# Altium schematic sheet 12V_Jetson.SchDoc
size A; SheetNumber: 3; SheetTotal: 9
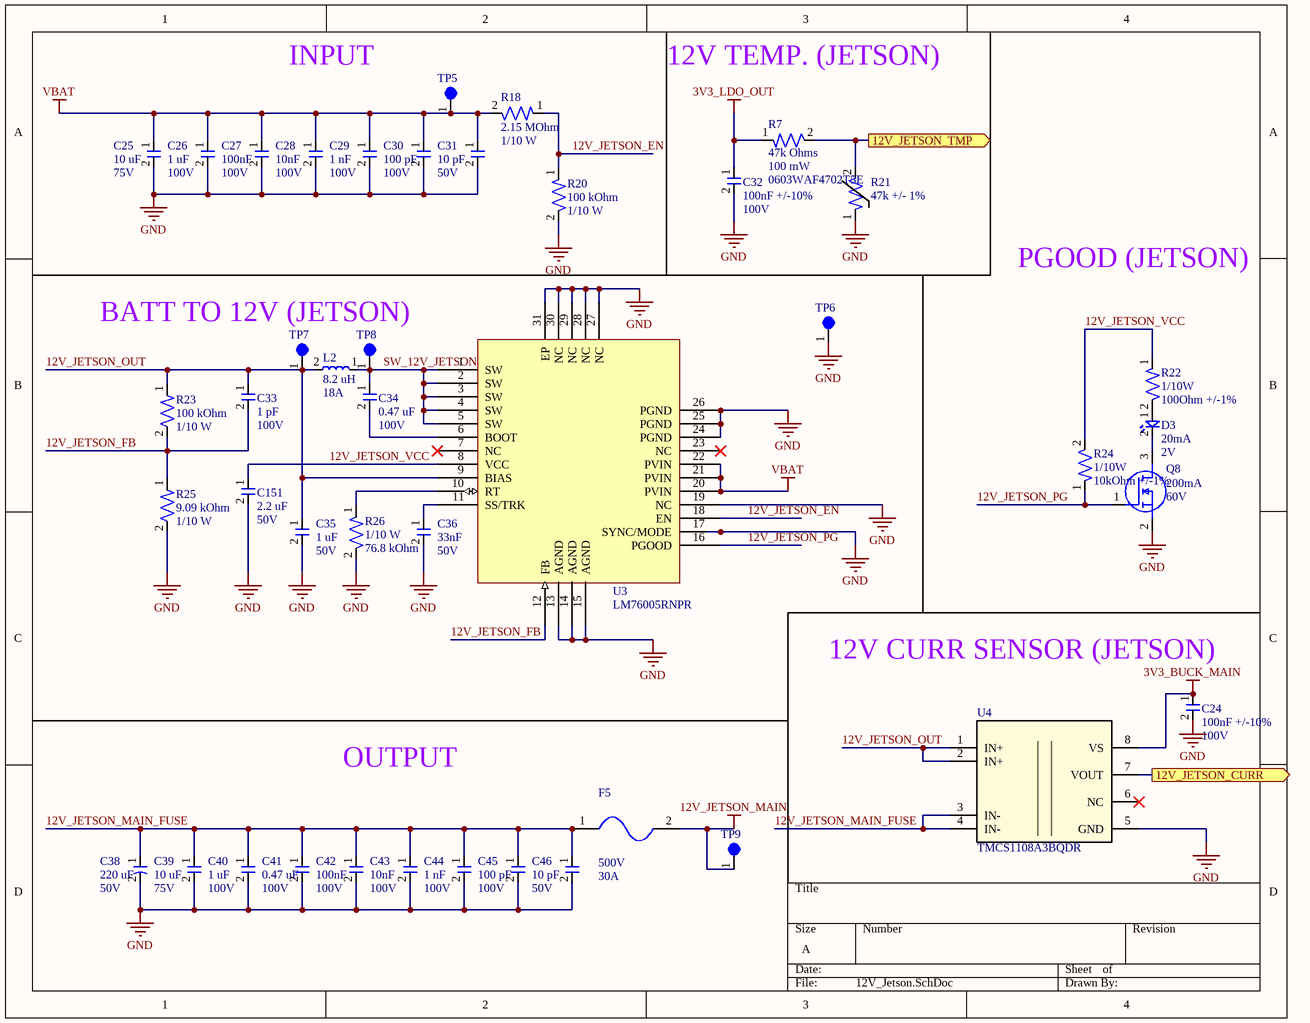
[diagram p0: 12V_Jetson.SchDoc]

## Parts
C24  Capacitance: 100nF +/-10%  Voltage Rating: 100V  [CAP-0603]  (hidden comment: CC0603KRX7R0BB104)
C25  Capacitance: 10 uF  Voltage Rating: 75V  [CAP-1210]  (hidden comment: C3225X7R1N106K250AC)
C26  Capacitance: 1 uF  Voltage: 100V  [CAP-1206 - duplicate]  (hidden comment: CL31B105KCHNNNE)
C27  Capacitance: 100nF  Voltage Rating: 100V  [CAP-0603]  (hidden comment: CC0603KRX7R0BB104)
C28  Capacitance: 10nF  Voltage Rating: 100V  [CAP-0603]  (hidden comment: C1608C0G2A103J080AC)
C29  Capacitance: 1 nF  Voltage: 100V  [CAP-0603]  (hidden comment: C0603Y102K1RAC7867)
C30  Capacitance: 100 pF  Voltage: 100V  [CAP-0603]  (hidden comment: 0603N101J101CT)
C31  Capacitance: 10 pF  Voltage Rating: 50V  [CAP-0603]  (hidden comment: 0603N100J500CT)
C32  Capacitance: 100nF +/-10%  Voltage Rating: 100V  [CAP-0603]  (hidden comment: CC0603KRX7R0BB104)
C33  Capacitance: 1 pF  Voltage: 100V  [CAP-0603]  (hidden comment: 885012006087)
C34  Capacitance: 0.47 uF  Voltage: 100V  [CAP-0805]  (hidden comment: KAM21KR72A474KL)
C35  Capacitance: 1 uF  Voltage: 50V  [CAP-0603]  (hidden comment: UMK107AB7105KA-T)
C36  Capacitance: 33nF  Voltage Rating: 50V  [CAP-0603]  (hidden comment: CC0603KRX7R9BB333)
C38  Capacitance: 220 uF  Voltage Rating: 50V  [ELEC-220U-0003]  (hidden comment: 50TZV220M10X10.5)
C39  Capacitance: 10 uF  Voltage Rating: 75V  [CAP-1210]  (hidden comment: C3225X7R1N106K250AC)
C40  Capacitance: 1 uF  Voltage: 100V  [CAP-1206 - duplicate]  (hidden comment: CL31B105KCHNNNE)
C41  Capacitance: 0.47 uF  Voltage: 100V  [CAP-0805]  (hidden comment: KAM21KR72A474KL)
C42  Capacitance: 100nF  Voltage Rating: 100V  [CAP-0603]  (hidden comment: CC0603KRX7R0BB104)
C43  Capacitance: 10nF  Voltage Rating: 100V  [CAP-0603]  (hidden comment: C1608C0G2A103J080AC)
C44  Capacitance: 1 nF  Voltage: 100V  [CAP-0603]  (hidden comment: C0603Y102K1RAC7867)
C45  Capacitance: 100 pF  Voltage: 100V  [CAP-0603]  (hidden comment: 0603N101J101CT)
C46  Capacitance: 10 pF  Voltage Rating: 50V  [CAP-0603]  (hidden comment: 0603N100J500CT)
C151  Capacitance: 2.2 uF  oltage: 50V  [CAP-0603]  (hidden comment: UMK107BBJ225KA-T)
D3  Current Rating: 20mA  Vf: 2V  [LED-0603]  (hidden comment: 150060AS75000)
F5  Voltage Rating: 500V  Current: 30A  [FUSE-ATM-0001]  (hidden comment: 3568)
L2  Inductance: 8.2 uH  DCI: 18A  [PWRIND-8.2U-0002]  (hidden comment: IHLP6767GZER8R2M01)
Q8  Id-Continuous: 200mA  VDS-Max: 60V  [NMOS-SOT23-3]  (hidden comment: T2N7002AK,LM)
R7  0603WAF4702T5E  [RES-0603]
R18  Resistance: 2.15 MOhm  Power: 1/10 W  [RES-0603]  (hidden comment: RC0603FR-072M15L)
R20  Resistance: 100 kOhm  Power: 1/10 W  [RES-0603]  (hidden comment: RC0603FR-07100KL)
R21  Resistance: 47k +/- 1%  [RES-0402]  (hidden comment: TMP6431DECR)
R22  Power Rating: 1/10W  Resistance: 100Ohm +/-1%  [RES-0603]  (hidden comment: AC0603FR-10100RL)
R23  Resistance: 100 kOhm  Power: 1/10 W  [RES-0603]  (hidden comment: RC0603FR-07100KL)
R24  Power Rating: 1/10W  Resistance: 10kOhm +/-1%  [RES-0603]  (hidden comment: RC0603FR-0710KP)
R25  Resistance: 9.09 kOhm  Power: 1/10 W  [RES-0603]  (hidden comment: RC0603FR-079K09L)
R26  Power: 1/10 W  Resistance: 76.8 kOhm  [RES-0603]  (hidden comment: RC0603FR-0776K8L)
TP5  5003  [TEST-POINT-0001]  (value not drawn)
TP6  5003  [TEST-POINT-0001]  (value not drawn)
TP7  5003  [TEST-POINT-0001]  (value not drawn)
TP8  5003  [TEST-POINT-0001]  (value not drawn)
TP9  5003  [TEST-POINT-0001]  (value not drawn)
U3  LM76005RNPR  [IC-30-WQFN(6x4)]
U4  TMCS1108A3BQDR  [D0008A-IPC_A]

## Ports
12V_JETSON_CURR (out, see can-stm32g4[2D]), 12V_JETSON_TMP (out, see can-stm32g4[2D])

## Nets
3V3_BUCK_MAIN: C24.1 U4.8(VS)
3V3_LDO_OUT: C32.1 R7.1
12V_JETSON_MAIN: F5.2 TP9.1
GND: C24.2 C25.2 C26.2 C27.2 C28.2 C29.2 C30.2 C31.2 C32.2 C35.2 C36.2 C38.2 C39.2 C40.2 C41.2 C42.2 C43.2 C44.2 C45.2 C46.2 C151.2 Q8.2(S) R20.2 R21.1 R25.2 R26.2 TP6.1 U3.13(AGND) U3.14(AGND) U3.15(AGND) U3.17(SYNC/MODE) U3.19(NC) U3.24(PGND) U3.25(PGND) U3.26(PGND) U3.27(NC) U3.28(NC) U3.29(NC) U3.30(NC) U3.31(EP) U4.5(GND)
VBAT: C25.1 C26.1 C27.1 C28.1 C29.1 C30.1 C31.1 R18.2 TP5.1 U3.20(PVIN) U3.21(PVIN) U3.22(PVIN)
12V_JETSON_CURR: U4.7(VOUT) ; port 12V_JETSON_CURR
12V_JETSON_EN: R18.1 R20.1 U3.18(EN)
12V_JETSON_FB: C33.2 R23.2 R25.1 U3.12(FB)
12V_JETSON_MAIN_FUSE: C38.1 C39.1 C40.1 C41.1 C42.1 C43.1 C44.1 C45.1 C46.1 F5.1 U4.3(IN-) U4.4(IN-)
12V_JETSON_OUT: C33.1 C35.1 L2.2 R23.1 TP7.1 U3.9(BIAS) U4.1(IN+) U4.2(IN+)
12V_JETSON_PG: Q8.1(G) R24.1 U3.16(PGOOD)
12V_JETSON_TMP: R7.2 R21.2 ; port 12V_JETSON_TMP
12V_JETSON_VCC: C151.1 R22.1 R24.2 U3.8(VCC)
SW_12V_JETSON: C34.1 L2.1 TP8.1 U3.1(SW) U3.2(SW) U3.3(SW) U3.4(SW) U3.5(SW)
NetC34_2: C34.2 U3.6(BOOT)
NetC36_1: C36.1 U3.11(SS/TRK)
NetD3_1: D3.1 R22.2
NetD3_2: D3.2 Q8.3(D)
NetR26_1: R26.1 U3.10(RT)

Not connected (* = marked no-connect by the designer): U3 7(NC)* 23(NC)*; U4 6(NC)*

## Notes on the sheet
- INPUT
- 12V TEMP. (JETSON)
- PGOOD (JETSON)
- BATT TO 12V (JETSON)
- (near C24) 12V CURR SENSOR (JETSON)
- OUTPUT
- (in symbol RES-47k-0001-JLC) 47k Ohms; 100 mW

## Library data of the parts
C24 C27 C32 C42 = CAP-100N-0001: CAP CER 0.1UF 100V X7R 0603; Manufacturer: YAGEO; Assembled?: no; Manufacturer Part Number: CC0603KRX7R0BB104; Temperature Coefficient: X7R; Package Size: 0603
C25 C39 = CAP-10U-0004: 10 µF ±10% 75V Ceramic Capacitor X7R 1210 (3225 Metric)
C26 C40 = CAP-1U-0001: 1 µF ±10% 100V Ceramic Capacitor X7R 1206 (3216 Metric)
C28 C43 = CAP-10N-0002: CAP CER 10000PF 100V C0G 0603; Manufacturer: TDK Corporation; Temperature Coefficient: C0G/NP0; Assembled?: no; Manufacturer Part Number: C1608C0G2A103J080AC; Package Size: 0603
C29 C44 = CAP-1N-0001: 1000 pF ±10% 100V Ceramic Capacitor X7R 0603 (1608 Metric)
C30 C45 = CAP-100P-0002: 100 pF ±5% 100V Ceramic Capacitor C0G, NP0 0603 (1608 Metric); Tolerance: +/-5%; Temp Coeff: C0G/NP0; Package Size: 0603
C31 C46 = CAP-10P-0001: 10 pF ±5% 50V Ceramic Capacitor C0G, NP0 0603 (1608 Metric); Manufacturer: Walshin Technology Corporation; Assembled?: Yes; Manufacturer Part Number: 0603N100J500CT; Temperature Coefficient: C0G, NP0; Package Size: 0603
C33 = CAP-1P-0001: 1 pF ±0.25pF 100V Ceramic Capacitor C0G, NP0 0603 (1608 Metric); Tolerance: +/- 0.25 pF; Temperature Coefficient: C0G/NP0; Assembled?: No; Package Size: 0603
C34 C41 = CAP-0.47U-0001: 0.47 µF ±10% 100V Ceramic Capacitor X7R 0805 (2012 Metric); Tolerance: +/- 10%; Assembled?: No; Temperature Coefficient: X7R; Package Size: 0805
C35 = CAP-1U-0002: 1 µF ±10% 50V Ceramic Capacitor X7R 0603 (1608 Metric); Package Size: 0603
C36 = CAP-33N-0001: 0.033 µF ±10% 50V Ceramic Capacitor X7R 0603 (1608 Metric); Manufacturer: YAGEO; Assembled?: no; Manufacturer Part Number: CC0603KRX7R9BB333; Temperature Coefficient: X7R; Package Size: 0603
C38 = ELEC-220U-0003: 220 µF 50 V Aluminum Electrolytic Capacitors Radial, Can - SMD 2000 Hrs @ 105°C; Size: .406inx.406in*.413in
C151 = CAP-2.2U-0001: 2.2 µF ±10% 50V Ceramic Capacitor X5R 0603 (1608 Metric)
D3 = LED_Amber_0001: CAP CER 0.1UF 100V X7R 0603; Manufacturer: Wurth Electronik; Assembled?: no; Color: Amber; Manufacturer Part Number: 150060AS75000; Package Size: 0603
F5 = FUSE-ATM-0001: Fuse Holder 30 A 500V 1 Circuit Blade Through Hole; Manufacturer Part Number: 3568
L2 = PWRIND-8.2U-0002: 8.2 µH Shielded Molded Inductor 18 A 10.66mOhm Max Nonstandard; Isat: 25A; Tolerance: +/-20%; DCR: 10.66 mOhm
Q8 = NMOS-200MA-0001: MOSFET N-CH 60V 200MA SOT23; Manufacturer: Toshiba; FET type: N-Channel; Rds On-Max: 3.9Ohm; Vgs-Max: 20V; Assembled?: no; Manufacturer Part Number: T2N7002AK,LM; Package: SOT-23-3
R7 = RES-47k-0001-JLC: 100mW Thick Film Resistors 75V ±100ppm/℃ ±1% 47kΩ 0603 Chip Resistor - Surface Mount ROHS; Resistance: 47kOhms; Power: 100mW
R18 = RES-2.15M-0001: 2.15 MOhms ±1% 0.1W, 1/10W Chip Resistor 0603 (1608 Metric) Moisture Resistant Thick Film; Tolerance: +/-1%; Assembled?: No; Package Size: 0603
R20 R23 = RES-100K-0003: 100 kOhms ±1% 0.1W, 1/10W Chip Resistor 0603 (1608 Metric) Moisture Resistant Thick Film; Tolerance: +/- 1%; Assembled?: No; Package Size: 0603
R21 = THERM-47K-0001: PTC Thermistor 47 kOhms 0402 (1006 Metric); Manufacturer: Texas Instruments; Manufacturer Part Number: TMP6431DECR; Package Size: 0402
R22 = RES-100-0002: 100 Ohms ±1% 0.1W, 1/10W Chip Resistor 0603 (1608 Metric) Automotive AEC-Q200 Thick Film; Manufacturer: YAGEO; Assembled?: no; Manufacturer Part Number: AC0603FR-10100RL; Package Size: 0603
R24 = RES-10K-0002: RES SMD 10K OHM 1% 1/10W 0603; Manufacturer: YAGEO; Assembled?: no; Manufacturer Part Number: RC0603FR-0710KP; Package Size: 0603
R25 = RES-9.09K-0001: 9.09 kOhms ±1% 0.1W, 1/10W Chip Resistor 0603 (1608 Metric) Moisture Resistant Thick Film; Tolerance: +/-1%; Assembled?: No; Package Size: 0603
R26 = RES-76.8K-0001: 76.8 kOhms ±1% 0.1W, 1/10W Chip Resistor 0603 (1608 Metric) Moisture Resistant Thick Film; Manufacturer: Yageo; Tolerance: +/- 1%; Package Size: 0603
TP5-TP9 = TEST-POINT-0001: Oranange PC Test Point, Miniature Phoisphor Bronze Silver Plating Through Hole Mounting Type
U3 = IC-BUCK-0006: Buck Switching Regulator IC Positive Adjustable 1V 1 Output 5A 30-WFQFN Exposed Pad; Manufacturer: Texas Instruments; Assembled?: no; Manufacturer Part Number: LM76005RNPR; Type: Buck; Package: 30-WFQFN; Current: LM76005RNPR
U4 = IC-CURRENT-0005: Mfr_Name: Texas Instruments; TYPE: TYPE; RefDes: RefDes